# Altium schematic sheet 4_Supply.SchDoc
size A4; DocumentNumber: 3; SheetNumber: 4; SheetTotal: 6
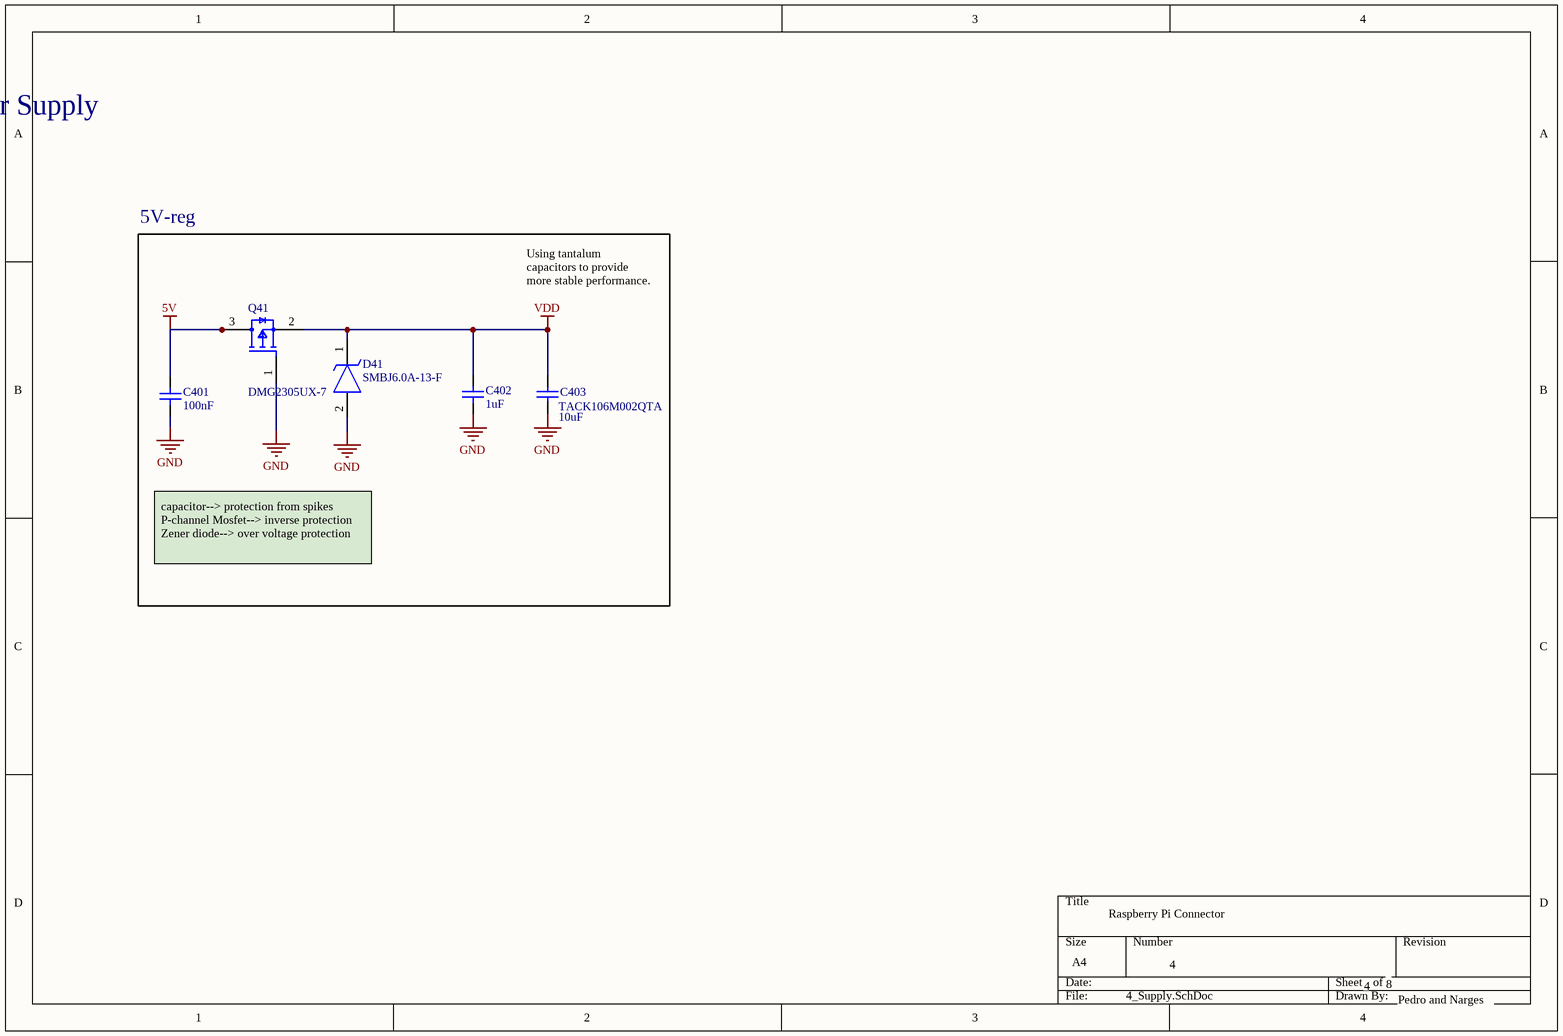
[diagram p0: 4_Supply.SchDoc]

## Parts
C401  value 100nF  [CAPC1005X55X30LL05T10]  (hidden comment: generic)
C402  value 1uF  [CAPC1005X55X30LL05T10]  (hidden comment: generic)
C403  TACK106M002QTA  value 10uF  [CAPC1005X70X10LL20T00]
D41  SMBJ6.0A-13-F  [SMBJ12A]
Q41  DMG2305UX-7  [FP-SOT23-IPC_B]

## Blocks framed on the sheet
5V-reg: C401-C403 D41 Q41

## Nets
5V: C401.1 Q41.3(DRAIN)
GND: C401.2 C402.2 C403.1 D41.2(A) Q41.1(GATE)
VDD: C402.1 C403.2 D41.1(K) Q41.2(SOURCE)

## Notes on the sheet
- [4] 4_EIT_Power Supply
- Using tantalum capacitors to provide more stable performance.
- capacitor--> protection from spikes   P-channel Mosfet--> inverse protection    Zener diode--> over voltage protection
- Raspberry Pi Connector
- Power Supply
- 4
- 8
- Pedro and Narges

## Library data of the parts
C401 C402 = Capacitor: Device Class L1: Passive Components; Device Class L2: Capacitors
C403 = CAP: Manufacturer: AVX Interconnect / Elco; Part Number: TACK106M002QTA
D41 = SMBJ6.0A-13-F: TVS Diode (Uni-directional); Manufacturer_Name: Diodes Incorporated; Datasheet Link: https://www.mouser.com/datasheet/2/115/ds19002-1078141.pdf; Height: 2.5mm; Manufacturer_Part_Number: SMBJ6.0A-13-F; Mouser Part Number: 621-SMBJ6.0A-13-F; Mouser Price/Stock: https://www.mouser.co.uk/ProductDetail/Diodes-Incorporated/SMBJ60A-13-F?qs=gaDBXWSqsDAIOdP0T6ZIBg%3D%3D; Arrow Part Number: SMBJ6.0A-13-F; Arrow Price/Stock: https://www.arrow.com/en/products/smbj6.0a-13-f/diodes-incorporated?region=nac
Q41 = CMP-1693-00002-4: MOSFET P-CH 20V 4.2A SOT23; Turn-On Delay Time: 10.8ns; Turn-Off Delay Time: 79.3ns; Threshold Voltage: -900mV; Rise Time: 13.7ns; Gate to Source Voltage (Vgs): 8V; Rds On Max: 52mR; Element Configuration: Single; Fall Time: 34.7ns; Max Power Dissipation: 1.4W; Drain to Source Resistance: 200mR; Number of Channels: 1; Input Capacitance: 808pF; Lead Free: Lead Free; Number of Pins: 3; Length: 3mm; Continuous Drain Current (ID): 4.2A; Contact Plating: Tin; Mount: Surface Mount; Weight: 0.000282oz; Min Operating Temperature: -55°C; Package Quantity: 3000; Drain to Source Voltage (Vdss): 20V; On-State Resistance: 52MR; Max Operating Temperature: 150°C; Height: 1.1mm; REACH SVHC: No SVHC; Packaging: Tape and Reel; Radiation Hardening: No; Case/Package: SOT-23; Width: 1.4mm